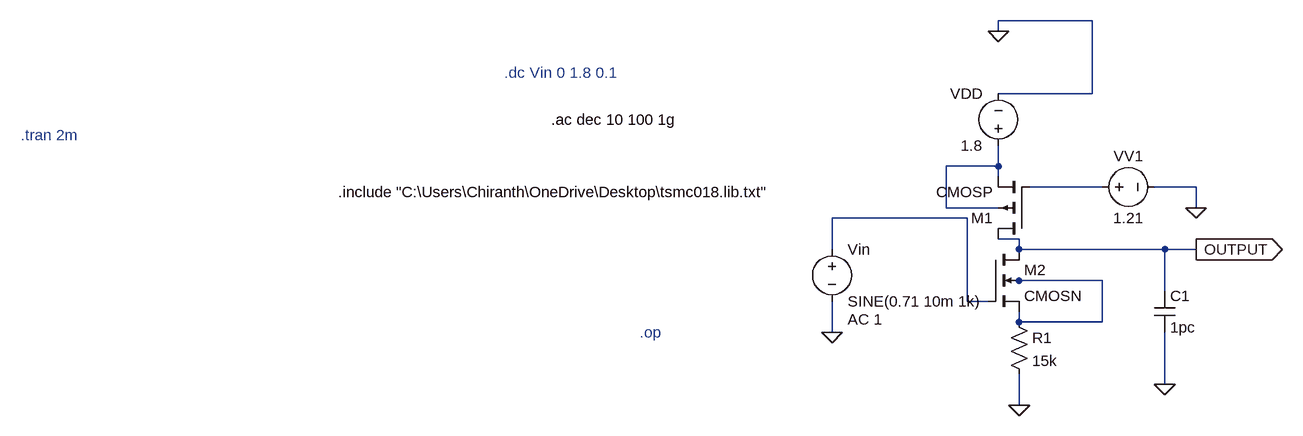
[diagram p0: schematic lab 2 lic.asc]
lab 2 lic.asc, the LTspice schematic file:
Version 4.1
SHEET 1 880 680
WIRE 416 -64 272 -64
WIRE 272 -48 272 -64
WIRE 416 48 416 -64
WIRE 416 48 272 48
WIRE 272 160 272 128
WIRE 272 160 192 160
WIRE 272 176 272 160
WIRE 432 192 320 192
WIRE 576 192 512 192
WIRE 192 224 192 160
WIRE 272 224 192 224
WIRE 576 224 576 192
WIRE 224 240 16 240
WIRE 304 272 272 272
WIRE 16 288 16 240
WIRE 304 288 304 272
WIRE 528 288 304 288
WIRE 576 288 528 288
WIRE 304 336 288 336
WIRE 432 336 304 336
WIRE 528 352 528 288
WIRE 224 368 224 240
WIRE 256 368 224 368
WIRE 304 400 304 384
WIRE 432 400 432 336
WIRE 432 400 304 400
WIRE 16 416 16 368
WIRE 528 496 528 416
WIRE 304 528 304 480
FLAG 576 224 0
FLAG 272 -48 0
FLAG 304 528 0
FLAG 16 416 0
FLAG 576 288 OUTPUT
IOPIN 576 288 Out
FLAG 528 496 0
SYMBOL pmos4 320 272 R180
SYMATTR InstName M1
SYMATTR Value CMOSP
SYMATTR Value2 l=180nm w=3100nm
SYMBOL nmos4 256 288 R0
SYMATTR InstName M2
SYMATTR Value CMOSN
SYMATTR Value2 l=180nm w=391nm
SYMBOL res 288 384 R0
SYMATTR InstName R1
SYMATTR Value 15k
SYMBOL voltage 272 144 R180
WINDOW 0 24 96 Left 2
WINDOW 3 24 16 Left 2
SYMATTR InstName VDD
SYMATTR Value 1.8
SYMBOL voltage 416 192 R270
WINDOW 0 32 56 VTop 2
WINDOW 3 -32 56 VBottom 2
SYMATTR InstName VV1
SYMATTR Value 1.21
SYMBOL voltage 16 272 R0
WINDOW 123 24 124 Left 2
WINDOW 39 0 0 Left 0
SYMATTR InstName Vin
SYMATTR Value SINE(0.71 10m 1k)
SYMATTR Value2 AC 1
SYMBOL cap 512 352 R0
SYMATTR InstName C1
SYMATTR Value 1pc
TEXT -744 200 Left 2 !.include "C:\\Users\\Chiranth\\OneDrive\\Desktop\\tsmc018.lib.txt"
TEXT -280 416 Left 2 ;.op
TEXT -488 16 Left 2 ;.dc Vin 0 1.8 0.1
TEXT -1232 112 Left 2 ;.tran 2m
TEXT -416 88 Left 2 !.ac dec 10 100 1g

The netlist it stands for:
* lab 2 lic.asc
M1 OUTPUT N002 N001 N001 CMOSP l=180nm w=3100nm
M2 OUTPUT N003 N004 N004 CMOSN l=180nm w=391nm
R1 N004 0 15k
VDD N001 0 1.8
VV1 N002 0 1.21
Vin N003 0 SINE(0.71 10m 1k) AC 1
C1 OUTPUT 0 1pc
.model NMOS NMOS
.model PMOS PMOS
.lib standard.mos
.include "C:\Users\Chiranth\OneDrive\Desktop\tsmc018.lib.txt"
* .op
* .dc Vin 0 1.8 0.1
* .tran 2m
.ac dec 10 100 1g
.backanno
.end